# Altium project PCB_Project.PrjPcb
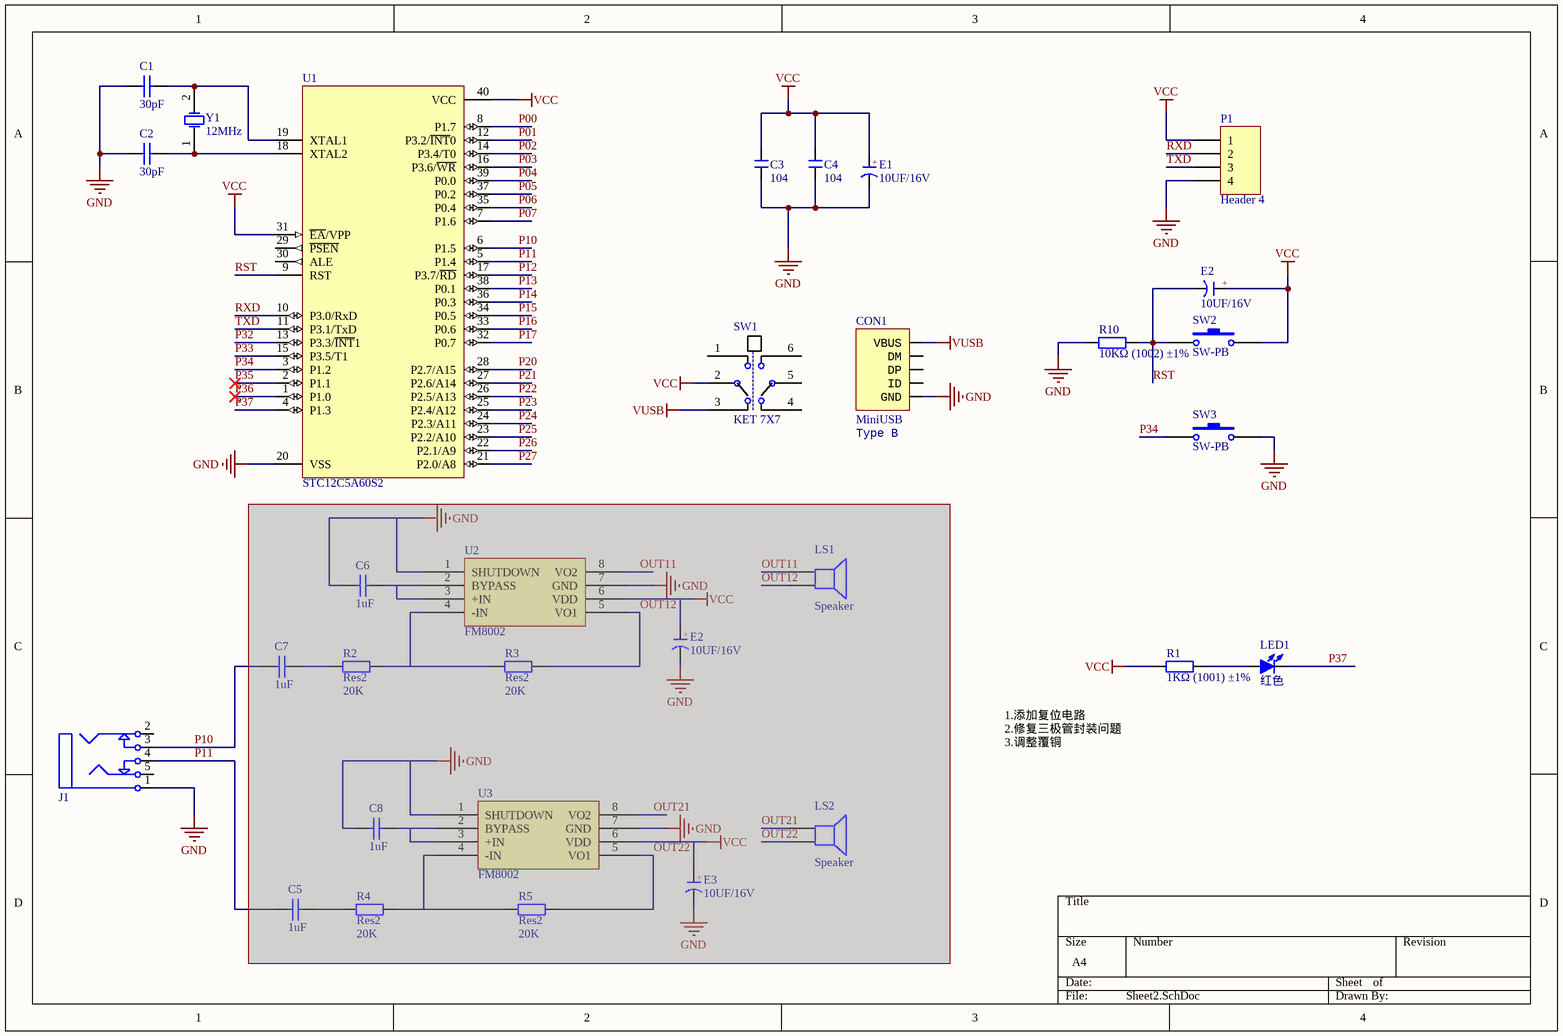
[diagram p0: Sheet2.SchDoc]
2 sheets, 191 parts. Net scope: global (net labels, ports and power ports of the same name join across sheets).
Board file: PCB1.PcbDoc
Sheets:
  Sheet2.SchDoc
  Sheet3.SchDoc

## Sheet Sheet2.SchDoc
size A4

### Parts
(Parts that share a designator on the sheet are numbered #1, #2 ... from top to bottom, then left to right.)
C1  value 30pF  [RAD-0.1]  (hidden comment: Cap)
C2  value 30pF  [RAD-0.1]  (hidden comment: Cap)
C3  104  [C 0805]
C4  104  [C 0805]
C5  value 1uF  [0402]  (hidden comment: Cap)  (masked out: inside a compile mask, not in the netlist)
C6  value 1uF  [0402]  (hidden comment: Cap)  (masked out: inside a compile mask, not in the netlist)
C7  value 1uF  [0402]  (hidden comment: Cap)  (masked out: inside a compile mask, not in the netlist)
C8  value 1uF  [0402]  (hidden comment: Cap)  (masked out: inside a compile mask, not in the netlist)
CON1  MiniUSB  value Type B  [USB_Mini-B]
E1  10UF/16V  [CAP 1.5*4*8]
E2#1  10UF/16V  [CAP 1.5*4*8]
E2#2  10UF/16V  [CAP 1.5*4*8]  (masked out: inside a compile mask, not in the netlist)
E3  10UF/16V  [CAP 1.5*4*8]  (masked out: inside a compile mask, not in the netlist)
J1  3F07_BK  [3F07_BK]  (value not drawn)
LED1  红色  [LED 0603R]
LS1  Speaker  [PIN2]  (masked out: inside a compile mask, not in the netlist)
LS2  Speaker  [PIN2]  (masked out: inside a compile mask, not in the netlist)
P1  Header 4  [HDR1X4]
R1  1KΩ (1001) ±1%  [0603_R]
R2#1  Res2  value 20K  [AXIAL-0.4]  (masked out: inside a compile mask, not in the netlist)
R3#1  Res2  value 20K  [AXIAL-0.4]  (masked out: inside a compile mask, not in the netlist)
R4#1  Res2  value 20K  [AXIAL-0.4]  (masked out: inside a compile mask, not in the netlist)
R5#1  Res2  value 20K  [AXIAL-0.4]  (masked out: inside a compile mask, not in the netlist)
R10  10KΩ (1002) ±1%  [0805_R]
SW1  KET 7X7  [KFT DIP-7X7]
SW2  SW-PB  [TSW DIP-6*6*5]
SW3  SW-PB  [TSW DIP-6*6*5]
U1  STC12C5A60S2  [DIP40]
U2  FM8002  (masked out: inside a compile mask, not in the netlist)
U3  FM8002  (masked out: inside a compile mask, not in the netlist)
Y1  12MHz  [XTAL_49H-0.2]

### Nets
GND: C1.2 C2.2 C3.1 C4.1 CON1.5(GND) E1.2(K) J1.1 P1.4 R10.1 SW3.2 U1.20(VSS)
VCC: C3.2 C4.2 E1.1(A) E2#1.1(A) P1.1 R1.1 SW1.2 SW2.2 U1.31(~{EA}/VPP) U1.40(VCC)
VUSB: CON1.1(VBUS) SW1.3
P00: U1.8(P1.7)
P01: U1.12(P3.2/~{INT}0)
P02: U1.14(P3.4/T0)
P03: U1.16(P3.6/~{WR})
P04: U1.39(P0.0)
P05: U1.37(P0.2)
P06: U1.35(P0.4)
P07: U1.7(P1.6)
P10: J1.3 U1.6(P1.5)
P11: J1.4 U1.5(P1.4)
P12: U1.17(P3.7/~{RD})
P13: U1.38(P0.1)
P14: U1.36(P0.3)
P15: U1.34(P0.5)
P16: U1.33(P0.6)
P17: U1.32(P0.7)
P20: U1.28(P2.7/A15)
P21: U1.27(P2.6/A14)
P22: U1.26(P2.5/A13)
P23: U1.25(P2.4/A12)
P24: U1.24(P2.3/A11)
P25: U1.23(P2.2/A10)
P26: U1.22(P2.1/A9)
P27: U1.21(P2.0/A8)
P32: U1.13(P3.3/~{INT}1)
P33: U1.15(P3.5/T1)
P34: SW3.1 U1.3(P1.2)
P35: U1.2(P1.1)
P36: U1.1(P1.0)
P37: LED1.2(K) U1.4(P1.3)
RST: E2#1.2(K) R10.2 SW2.1 U1.9(RST)
RXD: P1.2 U1.10(P3.0/RxD)
TXD: P1.3 U1.11(P3.1/TxD)
NetC1_1: C1.1 U1.19(XTAL1) Y1.2(OSC2)
NetC2_1: C2.1 U1.18(XTAL2) Y1.1(OSC1)
NetLED1_1: LED1.1(A) R1.2

Not connected (* = marked no-connect by the designer): CON1 0(SH) 2(DM) 3(DP) 4(ID); J1 2 5; SW1 1 4 5 6; U1 29(~{PSEN}) 30(ALE)

### Notes on the sheet
- 1.添加复位电路
  2.修复三极管封装问题
  3.调整覆铜
- (in symbol C-CAP) +
- (in symbol KET 7X7) ---------------

### Library data of the parts
C1 C2 C5-C8 = Cap: Capacitor; Published: 8-Jun-2000; LatestRevisionDate: 17-Jul-2002; LatestRevisionNote: Re-released for DXP Platform.; PackageReference: RAD-0.3; Publisher: Altium Limited
C3 C4 = C: 无极性贴片电容; 版权归属: 源创客; BOM名称: 无极性贴片电容; 学习资源: www.ooocke.com
CON1 = USB_Mini: USB; Type: *
E1 E2#1 E2#2 E3 = C-CAP: 直插电解电容; 版权归属: 源创客; BOM名称: 直插电解电容; 学习资源: www.ooocke.com
J1 = 3F07: 3.5mm耳机插座; BOM名称: 耳机插座; 版权归属: 源创客; 学习资源: www.ooocke.com
LED1 = LED-3MM: 插件LED; 版权归属: 源创客; BOM名称: 插件LED; 学习资源: www.ooocke.com
LS1 LS2 = Speaker: Loudspeaker; Published: 24-Mar-1999; LatestRevisionDate: 17-Jul-2002; LatestRevisionNote: Re-released for DXP Platform.; PackageReference: PIN2; Publisher: Altium Limited
P1 = Header 4: Header, 4-Pin; LatestRevisionDate: 17-Jul-2002; LatestRevisionNote: Re-released for DXP Platform.; Publisher: Altium Limited
R1 = 0603 1KΩ (1001) 1%: 贴片电阻; ComponentLink1Description: 供应商链接; ComponentLink1URL: http://www.szlcsc.com/product/details_21904.html; Package: 0603; Supplier: LC; SuppliersPartNumber: C21190
R2#1 R3#1 R4#1 R5#1 = Res2: Resistor; Published: 8-Jun-2000; LatestRevisionDate: 17-Jul-2002; LatestRevisionNote: Re-released for DXP Platform.; PackageReference: AXIAL-0.4; Publisher: Altium Limited; PackageDescription: Axial Device, Thru-Hole; 2 Leads; 0.4 in Pin Spacing
R10 = 0805 10KΩ (1002) 1%: 贴片电阻; ComponentLink1Description: 供应商链接; ComponentLink1URL: http://www.szlcsc.com/product/details_18102.html; Package: 0805; Supplier: LC; SuppliersPartNumber: C17414
SW1 = KET 7X7: 7*7开关; 版权归属: 源创客; BOM名称: 7*7开关; 学习资源: www.ooocke.com
SW2 SW3 = SW-PB: Switch; Published: 24-Mar-1999; LatestRevisionDate: 17-Jul-2002; LatestRevisionNote: Re-released for DXP Platform.; PackageReference: SPST-2; Publisher: Altium Limited; PackageDescription: Switch; 2 Leads
U1 = AT89C51: 8-bit MCU
Y1 = XTAL: Crystal Oscillator; Published: 8-Jun-2000; LatestRevisionDate: 17-Jul-2002; LatestRevisionNote: Re-released for DXP Platform.; PackageReference: R38; Publisher: Altium Limited

## Sheet Sheet3.SchDoc
size A2
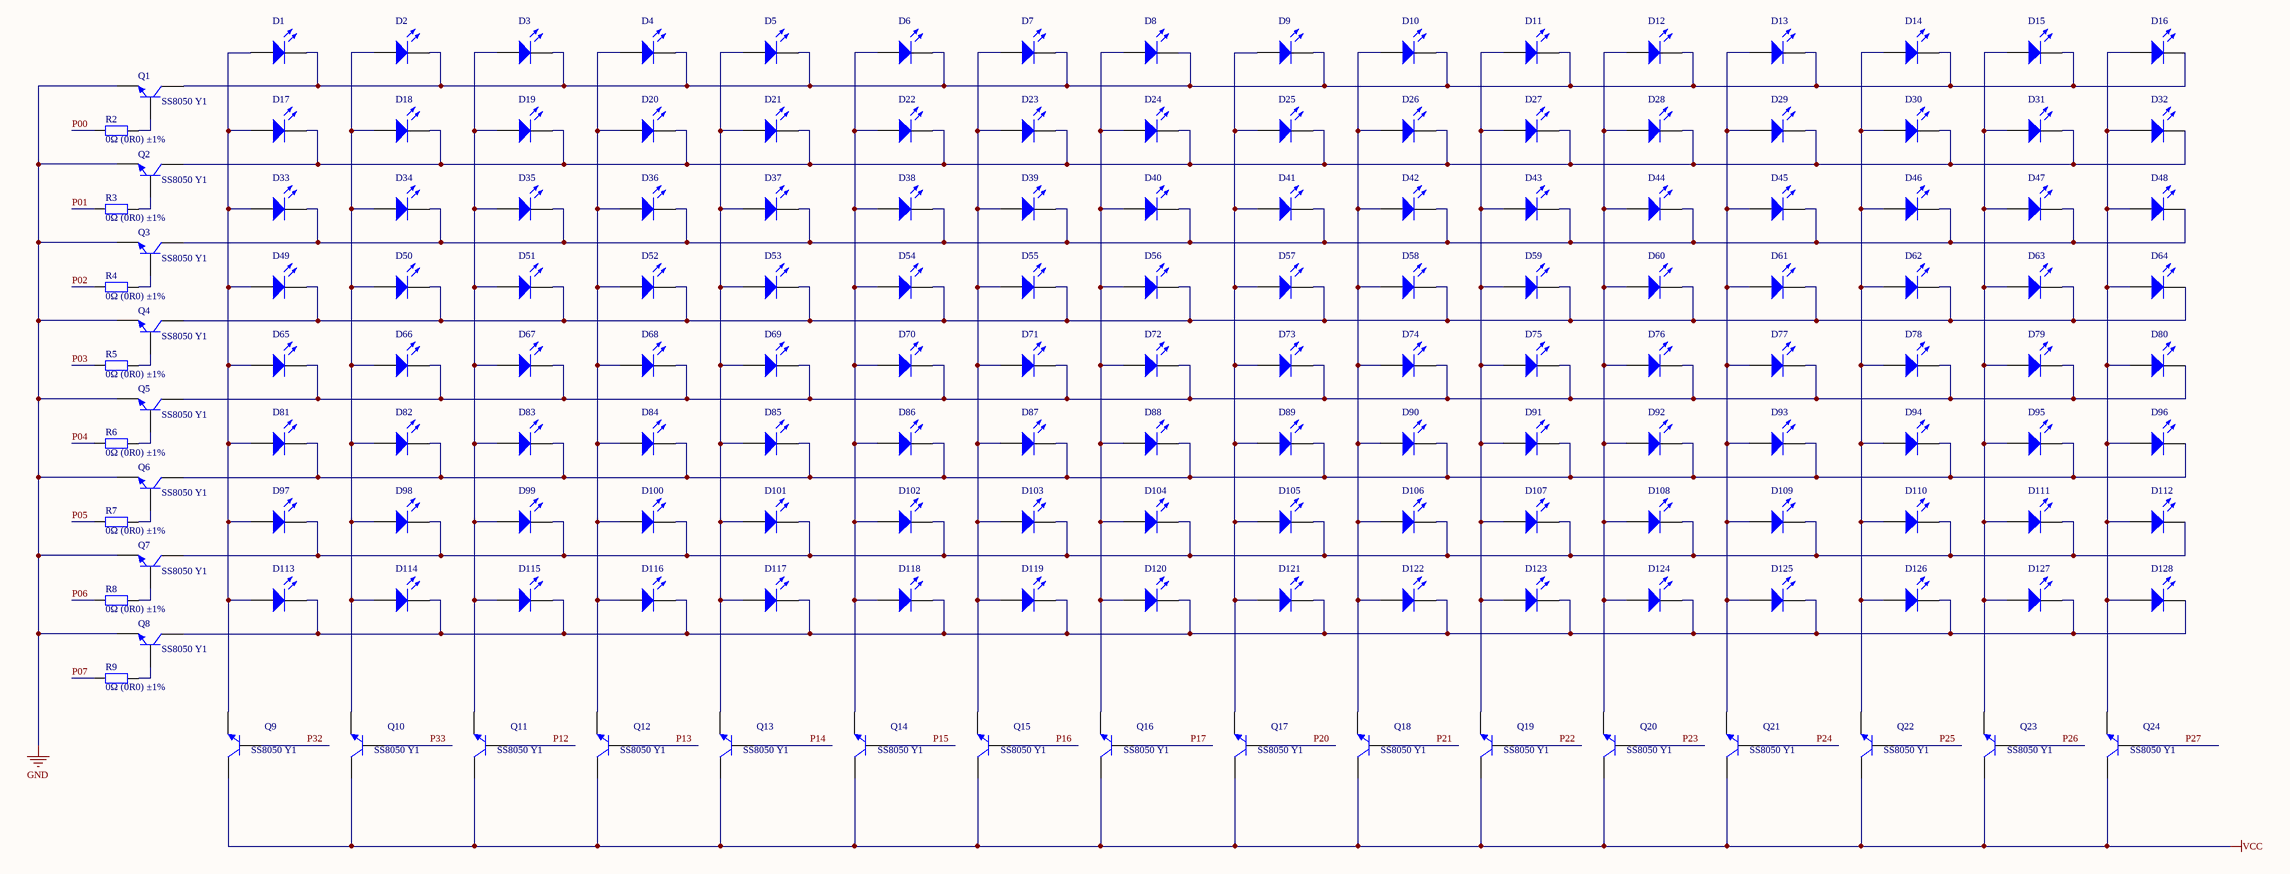
[diagram p1: Sheet3.SchDoc]

### Parts
(Parts that share a designator on the sheet are numbered #1, #2 ... from top to bottom, then left to right.)
D1  LED0  [LED 3MM-R]  (value not drawn)
D2  LED0  [LED 3MM-R]  (value not drawn)
D3  LED0  [LED 3MM-R]  (value not drawn)
D4  LED0  [LED 3MM-R]  (value not drawn)
D5  LED0  [LED 3MM-R]  (value not drawn)
D6  LED0  [LED 3MM-R]  (value not drawn)
D7  LED0  [LED 3MM-R]  (value not drawn)
D8  LED0  [LED 3MM-R]  (value not drawn)
D9  LED0  [LED 3MM-R]  (value not drawn)
D10  LED0  [LED 3MM-R]  (value not drawn)
D11  LED0  [LED 3MM-R]  (value not drawn)
D12  LED0  [LED 3MM-R]  (value not drawn)
D13  LED0  [LED 3MM-R]  (value not drawn)
D14  LED0  [LED 3MM-R]  (value not drawn)
D15  LED0  [LED 3MM-R]  (value not drawn)
D16  LED0  [LED 3MM-R]  (value not drawn)
D17  LED0  [LED 3MM-R]  (value not drawn)
D18  LED0  [LED 3MM-R]  (value not drawn)
D19  LED0  [LED 3MM-R]  (value not drawn)
D20  LED0  [LED 3MM-R]  (value not drawn)
D21  LED0  [LED 3MM-R]  (value not drawn)
D22  LED0  [LED 3MM-R]  (value not drawn)
D23  LED0  [LED 3MM-R]  (value not drawn)
D24  LED0  [LED 3MM-R]  (value not drawn)
D25  LED0  [LED 3MM-R]  (value not drawn)
D26  LED0  [LED 3MM-R]  (value not drawn)
D27  LED0  [LED 3MM-R]  (value not drawn)
D28  LED0  [LED 3MM-R]  (value not drawn)
D29  LED0  [LED 3MM-R]  (value not drawn)
D30  LED0  [LED 3MM-R]  (value not drawn)
D31  LED0  [LED 3MM-R]  (value not drawn)
D32  LED0  [LED 3MM-R]  (value not drawn)
D33  LED0  [LED 3MM-R]  (value not drawn)
D34  LED0  [LED 3MM-R]  (value not drawn)
D35  LED0  [LED 3MM-R]  (value not drawn)
D36  LED0  [LED 3MM-R]  (value not drawn)
D37  LED0  [LED 3MM-R]  (value not drawn)
D38  LED0  [LED 3MM-R]  (value not drawn)
D39  LED0  [LED 3MM-R]  (value not drawn)
D40  LED0  [LED 3MM-R]  (value not drawn)
D41  LED0  [LED 3MM-R]  (value not drawn)
D42  LED0  [LED 3MM-R]  (value not drawn)
D43  LED0  [LED 3MM-R]  (value not drawn)
D44  LED0  [LED 3MM-R]  (value not drawn)
D45  LED0  [LED 3MM-R]  (value not drawn)
D46  LED0  [LED 3MM-R]  (value not drawn)
D47  LED0  [LED 3MM-R]  (value not drawn)
D48  LED0  [LED 3MM-R]  (value not drawn)
D49  LED0  [LED 3MM-R]  (value not drawn)
D50  LED0  [LED 3MM-R]  (value not drawn)
D51  LED0  [LED 3MM-R]  (value not drawn)
D52  LED0  [LED 3MM-R]  (value not drawn)
D53  LED0  [LED 3MM-R]  (value not drawn)
D54  LED0  [LED 3MM-R]  (value not drawn)
D55  LED0  [LED 3MM-R]  (value not drawn)
D56  LED0  [LED 3MM-R]  (value not drawn)
D57  LED0  [LED 3MM-R]  (value not drawn)
D58  LED0  [LED 3MM-R]  (value not drawn)
D59  LED0  [LED 3MM-R]  (value not drawn)
D60  LED0  [LED 3MM-R]  (value not drawn)
D61  LED0  [LED 3MM-R]  (value not drawn)
D62  LED0  [LED 3MM-R]  (value not drawn)
D63  LED0  [LED 3MM-R]  (value not drawn)
D64  LED0  [LED 3MM-R]  (value not drawn)
D65  LED0  [LED 3MM-R]  (value not drawn)
D66  LED0  [LED 3MM-R]  (value not drawn)
D67  LED0  [LED 3MM-R]  (value not drawn)
D68  LED0  [LED 3MM-R]  (value not drawn)
D69  LED0  [LED 3MM-R]  (value not drawn)
D70  LED0  [LED 3MM-R]  (value not drawn)
D71  LED0  [LED 3MM-R]  (value not drawn)
D72  LED0  [LED 3MM-R]  (value not drawn)
D73  LED0  [LED 3MM-R]  (value not drawn)
D74  LED0  [LED 3MM-R]  (value not drawn)
D75  LED0  [LED 3MM-R]  (value not drawn)
D76  LED0  [LED 3MM-R]  (value not drawn)
D77  LED0  [LED 3MM-R]  (value not drawn)
D78  LED0  [LED 3MM-R]  (value not drawn)
D79  LED0  [LED 3MM-R]  (value not drawn)
D80  LED0  [LED 3MM-R]  (value not drawn)
D81  LED0  [LED 3MM-R]  (value not drawn)
D82  LED0  [LED 3MM-R]  (value not drawn)
D83  LED0  [LED 3MM-R]  (value not drawn)
D84  LED0  [LED 3MM-R]  (value not drawn)
D85  LED0  [LED 3MM-R]  (value not drawn)
D86  LED0  [LED 3MM-R]  (value not drawn)
D87  LED0  [LED 3MM-R]  (value not drawn)
D88  LED0  [LED 3MM-R]  (value not drawn)
D89  LED0  [LED 3MM-R]  (value not drawn)
D90  LED0  [LED 3MM-R]  (value not drawn)
D91  LED0  [LED 3MM-R]  (value not drawn)
D92  LED0  [LED 3MM-R]  (value not drawn)
D93  LED0  [LED 3MM-R]  (value not drawn)
D94  LED0  [LED 3MM-R]  (value not drawn)
D95  LED0  [LED 3MM-R]  (value not drawn)
D96  LED0  [LED 3MM-R]  (value not drawn)
D97  LED0  [LED 3MM-R]  (value not drawn)
D98  LED0  [LED 3MM-R]  (value not drawn)
D99  LED0  [LED 3MM-R]  (value not drawn)
D100  LED0  [LED 3MM-R]  (value not drawn)
D101  LED0  [LED 3MM-R]  (value not drawn)
D102  LED0  [LED 3MM-R]  (value not drawn)
D103  LED0  [LED 3MM-R]  (value not drawn)
D104  LED0  [LED 3MM-R]  (value not drawn)
D105  LED0  [LED 3MM-R]  (value not drawn)
D106  LED0  [LED 3MM-R]  (value not drawn)
D107  LED0  [LED 3MM-R]  (value not drawn)
D108  LED0  [LED 3MM-R]  (value not drawn)
D109  LED0  [LED 3MM-R]  (value not drawn)
D110  LED0  [LED 3MM-R]  (value not drawn)
D111  LED0  [LED 3MM-R]  (value not drawn)
D112  LED0  [LED 3MM-R]  (value not drawn)
D113  LED0  [LED 3MM-R]  (value not drawn)
D114  LED0  [LED 3MM-R]  (value not drawn)
D115  LED0  [LED 3MM-R]  (value not drawn)
D116  LED0  [LED 3MM-R]  (value not drawn)
D117  LED0  [LED 3MM-R]  (value not drawn)
D118  LED0  [LED 3MM-R]  (value not drawn)
D119  LED0  [LED 3MM-R]  (value not drawn)
D120  LED0  [LED 3MM-R]  (value not drawn)
D121  LED0  [LED 3MM-R]  (value not drawn)
D122  LED0  [LED 3MM-R]  (value not drawn)
D123  LED0  [LED 3MM-R]  (value not drawn)
D124  LED0  [LED 3MM-R]  (value not drawn)
D125  LED0  [LED 3MM-R]  (value not drawn)
D126  LED0  [LED 3MM-R]  (value not drawn)
D127  LED0  [LED 3MM-R]  (value not drawn)
D128  LED0  [LED 3MM-R]  (value not drawn)
Q1  SS8050 Y1  [SOT-23(SOT-23-3)]
Q2  SS8050 Y1  [SOT-23(SOT-23-3)]
Q3  SS8050 Y1  [SOT-23(SOT-23-3)]
Q4  SS8050 Y1  [SOT-23(SOT-23-3)]
Q5  SS8050 Y1  [SOT-23(SOT-23-3)]
Q6  SS8050 Y1  [SOT-23(SOT-23-3)]
Q7  SS8050 Y1  [SOT-23(SOT-23-3)]
Q8  SS8050 Y1  [SOT-23(SOT-23-3)]
Q9  SS8050 Y1  [SOT-23(SOT-23-3)]
Q10  SS8050 Y1  [SOT-23(SOT-23-3)]
Q11  SS8050 Y1  [SOT-23(SOT-23-3)]
Q12  SS8050 Y1  [SOT-23(SOT-23-3)]
Q13  SS8050 Y1  [SOT-23(SOT-23-3)]
Q14  SS8050 Y1  [SOT-23(SOT-23-3)]
Q15  SS8050 Y1  [SOT-23(SOT-23-3)]
Q16  SS8050 Y1  [SOT-23(SOT-23-3)]
Q17  SS8050 Y1  [SOT-23(SOT-23-3)]
Q18  SS8050 Y1  [SOT-23(SOT-23-3)]
Q19  SS8050 Y1  [SOT-23(SOT-23-3)]
Q20  SS8050 Y1  [SOT-23(SOT-23-3)]
Q21  SS8050 Y1  [SOT-23(SOT-23-3)]
Q22  SS8050 Y1  [SOT-23(SOT-23-3)]
Q23  SS8050 Y1  [SOT-23(SOT-23-3)]
Q24  SS8050 Y1  [SOT-23(SOT-23-3)]
R2#2  0Ω (0R0) ±1%  [0805_R]
R3#2  0Ω (0R0) ±1%  [0805_R]
R4#2  0Ω (0R0) ±1%  [0805_R]
R5#2  0Ω (0R0) ±1%  [0805_R]
R6  0Ω (0R0) ±1%  [0805_R]
R7  0Ω (0R0) ±1%  [0805_R]
R8  0Ω (0R0) ±1%  [0805_R]
R9  0Ω (0R0) ±1%  [0805_R]

### Nets
GND: Q1.2(E) Q2.2(E) Q3.2(E) Q4.2(E) Q5.2(E) Q6.2(E) Q7.2(E) Q8.2(E)
VCC: Q9.3(C) Q10.3(C) Q11.3(C) Q12.3(C) Q13.3(C) Q14.3(C) Q15.3(C) Q16.3(C) Q17.3(C) Q18.3(C) Q19.3(C) Q20.3(C) Q21.3(C) Q22.3(C) Q23.3(C) Q24.3(C)
P00: R2#2.1
P01: R3#2.1
P02: R4#2.1
P03: R5#2.1
P04: R6.1
P05: R7.1
P06: R8.1
P07: R9.1
P12: Q11.1(B)
P13: Q12.1(B)
P14: Q13.1(B)
P15: Q14.1(B)
P16: Q15.1(B)
P17: Q16.1(B)
P20: Q17.1(B)
P21: Q18.1(B)
P22: Q19.1(B)
P23: Q20.1(B)
P24: Q21.1(B)
P25: Q22.1(B)
P26: Q23.1(B)
P27: Q24.1(B)
P32: Q9.1(B)
P33: Q10.1(B)
NetD1_1: D1.1(A) D17.1(A) D33.1(A) D49.1(A) D65.1(A) D81.1(A) D97.1(A) D113.1(A) Q9.2(E)
NetD1_2: D1.2(K) D2.2(K) D3.2(K) D4.2(K) D5.2(K) D6.2(K) D7.2(K) D8.2(K) D9.2(K) D10.2(K) D11.2(K) D12.2(K) D13.2(K) D14.2(K) D15.2(K) D16.2(K) Q1.3(C)
NetD2_1: D2.1(A) D18.1(A) D34.1(A) D50.1(A) D66.1(A) D82.1(A) D98.1(A) D114.1(A) Q10.2(E)
NetD3_1: D3.1(A) D19.1(A) D35.1(A) D51.1(A) D67.1(A) D83.1(A) D99.1(A) D115.1(A) Q11.2(E)
NetD4_1: D4.1(A) D20.1(A) D36.1(A) D52.1(A) D68.1(A) D84.1(A) D100.1(A) D116.1(A) Q12.2(E)
NetD5_1: D5.1(A) D21.1(A) D37.1(A) D53.1(A) D69.1(A) D85.1(A) D101.1(A) D117.1(A) Q13.2(E)
NetD6_1: D6.1(A) D22.1(A) D38.1(A) D54.1(A) D70.1(A) D86.1(A) D102.1(A) D118.1(A) Q14.2(E)
NetD7_1: D7.1(A) D23.1(A) D39.1(A) D55.1(A) D71.1(A) D87.1(A) D103.1(A) D119.1(A) Q15.2(E)
NetD8_1: D8.1(A) D24.1(A) D40.1(A) D56.1(A) D72.1(A) D88.1(A) D104.1(A) D120.1(A) Q16.2(E)
NetD9_1: D9.1(A) D25.1(A) D41.1(A) D57.1(A) D73.1(A) D89.1(A) D105.1(A) D121.1(A) Q17.2(E)
NetD10_1: D10.1(A) D26.1(A) D42.1(A) D58.1(A) D74.1(A) D90.1(A) D106.1(A) D122.1(A) Q18.2(E)
NetD11_1: D11.1(A) D27.1(A) D43.1(A) D59.1(A) D75.1(A) D91.1(A) D107.1(A) D123.1(A) Q19.2(E)
NetD12_1: D12.1(A) D28.1(A) D44.1(A) D60.1(A) D76.1(A) D92.1(A) D108.1(A) D124.1(A) Q20.2(E)
NetD13_1: D13.1(A) D29.1(A) D45.1(A) D61.1(A) D77.1(A) D93.1(A) D109.1(A) D125.1(A) Q21.2(E)
NetD14_1: D14.1(A) D30.1(A) D46.1(A) D62.1(A) D78.1(A) D94.1(A) D110.1(A) D126.1(A) Q22.2(E)
NetD15_1: D15.1(A) D31.1(A) D47.1(A) D63.1(A) D79.1(A) D95.1(A) D111.1(A) D127.1(A) Q23.2(E)
NetD16_1: D16.1(A) D32.1(A) D48.1(A) D64.1(A) D80.1(A) D96.1(A) D112.1(A) D128.1(A) Q24.2(E)
NetD17_2: D17.2(K) D18.2(K) D19.2(K) D20.2(K) D21.2(K) D22.2(K) D23.2(K) D24.2(K) D25.2(K) D26.2(K) D27.2(K) D28.2(K) D29.2(K) D30.2(K) D31.2(K) D32.2(K) Q2.3(C)
NetD33_2: D33.2(K) D34.2(K) D35.2(K) D36.2(K) D37.2(K) D38.2(K) D39.2(K) D40.2(K) D41.2(K) D42.2(K) D43.2(K) D44.2(K) D45.2(K) D46.2(K) D47.2(K) D48.2(K) Q3.3(C)
NetD49_2: D49.2(K) D50.2(K) D51.2(K) D52.2(K) D53.2(K) D54.2(K) D55.2(K) D56.2(K) D57.2(K) D58.2(K) D59.2(K) D60.2(K) D61.2(K) D62.2(K) D63.2(K) D64.2(K) Q4.3(C)
NetD65_2: D65.2(K) D66.2(K) D67.2(K) D68.2(K) D69.2(K) D70.2(K) D71.2(K) D72.2(K) D73.2(K) D74.2(K) D75.2(K) D76.2(K) D77.2(K) D78.2(K) D79.2(K) D80.2(K) Q5.3(C)
NetD81_2: D81.2(K) D82.2(K) D83.2(K) D84.2(K) D85.2(K) D86.2(K) D87.2(K) D88.2(K) D89.2(K) D90.2(K) D91.2(K) D92.2(K) D93.2(K) D94.2(K) D95.2(K) D96.2(K) Q6.3(C)
NetD97_2: D97.2(K) D98.2(K) D99.2(K) D100.2(K) D101.2(K) D102.2(K) D103.2(K) D104.2(K) D105.2(K) D106.2(K) D107.2(K) D108.2(K) D109.2(K) D110.2(K) D111.2(K) D112.2(K) Q7.3(C)
NetD113_2: D113.2(K) D114.2(K) D115.2(K) D116.2(K) D117.2(K) D118.2(K) D119.2(K) D120.2(K) D121.2(K) D122.2(K) D123.2(K) D124.2(K) D125.2(K) D126.2(K) D127.2(K) D128.2(K) Q8.3(C)
NetQ1_1: Q1.1(B) R2#2.2
NetQ2_1: Q2.1(B) R3#2.2
NetQ3_1: Q3.1(B) R4#2.2
NetQ4_1: Q4.1(B) R5#2.2
NetQ5_1: Q5.1(B) R6.2
NetQ6_1: Q6.1(B) R7.2
NetQ7_1: Q7.1(B) R8.2
NetQ8_1: Q8.1(B) R9.2

### Library data of the parts
D1-D128 = LED0: Typical INFRARED GaAs LED; Published: 8-Jun-2000; LatestRevisionDate: 08-Jul-2005; LatestRevisionNote: Mech Layer 1 removed.; PackageReference: LED-0; Publisher: Altium Limited; PackageDescription: LED; 2 Leads
Q1-Q24 = SOT-23 SS8050 Y1: 三极管; ComponentLink1Description: 供应商链接; ComponentLink1URL: http://www.szlcsc.com/product/details_2507.html; Package: SOT-23; Supplier: LC; SuppliersPartNumber: C2150
R2#2 R3#2 R4#2 R5#2 R6-R9 = 0805 0Ω (0R0) 1%: 贴片电阻; ComponentLink1Description: 供应商链接; ComponentLink1URL: http://www.szlcsc.com/product/details_18165.html; Package: 0805; Supplier: LC; SuppliersPartNumber: C17477

## Nets that join several sheets
GND: Sheet2 (11 pins), Sheet3 (8 pins)
VCC: Sheet2 (10 pins), Sheet3 (16 pins)
P00: Sheet2 (U1.8), Sheet3 (R2#2.1)
P01: Sheet2 (U1.12), Sheet3 (R3#2.1)
P02: Sheet2 (U1.14), Sheet3 (R4#2.1)
P03: Sheet2 (U1.16), Sheet3 (R5#2.1)
P04: Sheet2 (U1.39), Sheet3 (R6.1)
P05: Sheet2 (U1.37), Sheet3 (R7.1)
P06: Sheet2 (U1.35), Sheet3 (R8.1)
P07: Sheet2 (U1.7), Sheet3 (R9.1)
P12: Sheet2 (U1.17), Sheet3 (Q11.1)
P13: Sheet2 (U1.38), Sheet3 (Q12.1)
P14: Sheet2 (U1.36), Sheet3 (Q13.1)
P15: Sheet2 (U1.34), Sheet3 (Q14.1)
P16: Sheet2 (U1.33), Sheet3 (Q15.1)
P17: Sheet2 (U1.32), Sheet3 (Q16.1)
P20: Sheet2 (U1.28), Sheet3 (Q17.1)
P21: Sheet2 (U1.27), Sheet3 (Q18.1)
P22: Sheet2 (U1.26), Sheet3 (Q19.1)
P23: Sheet2 (U1.25), Sheet3 (Q20.1)
P24: Sheet2 (U1.24), Sheet3 (Q21.1)
P25: Sheet2 (U1.23), Sheet3 (Q22.1)
P26: Sheet2 (U1.22), Sheet3 (Q23.1)
P27: Sheet2 (U1.21), Sheet3 (Q24.1)
P32: Sheet2 (U1.13), Sheet3 (Q9.1)
P33: Sheet2 (U1.15), Sheet3 (Q10.1)